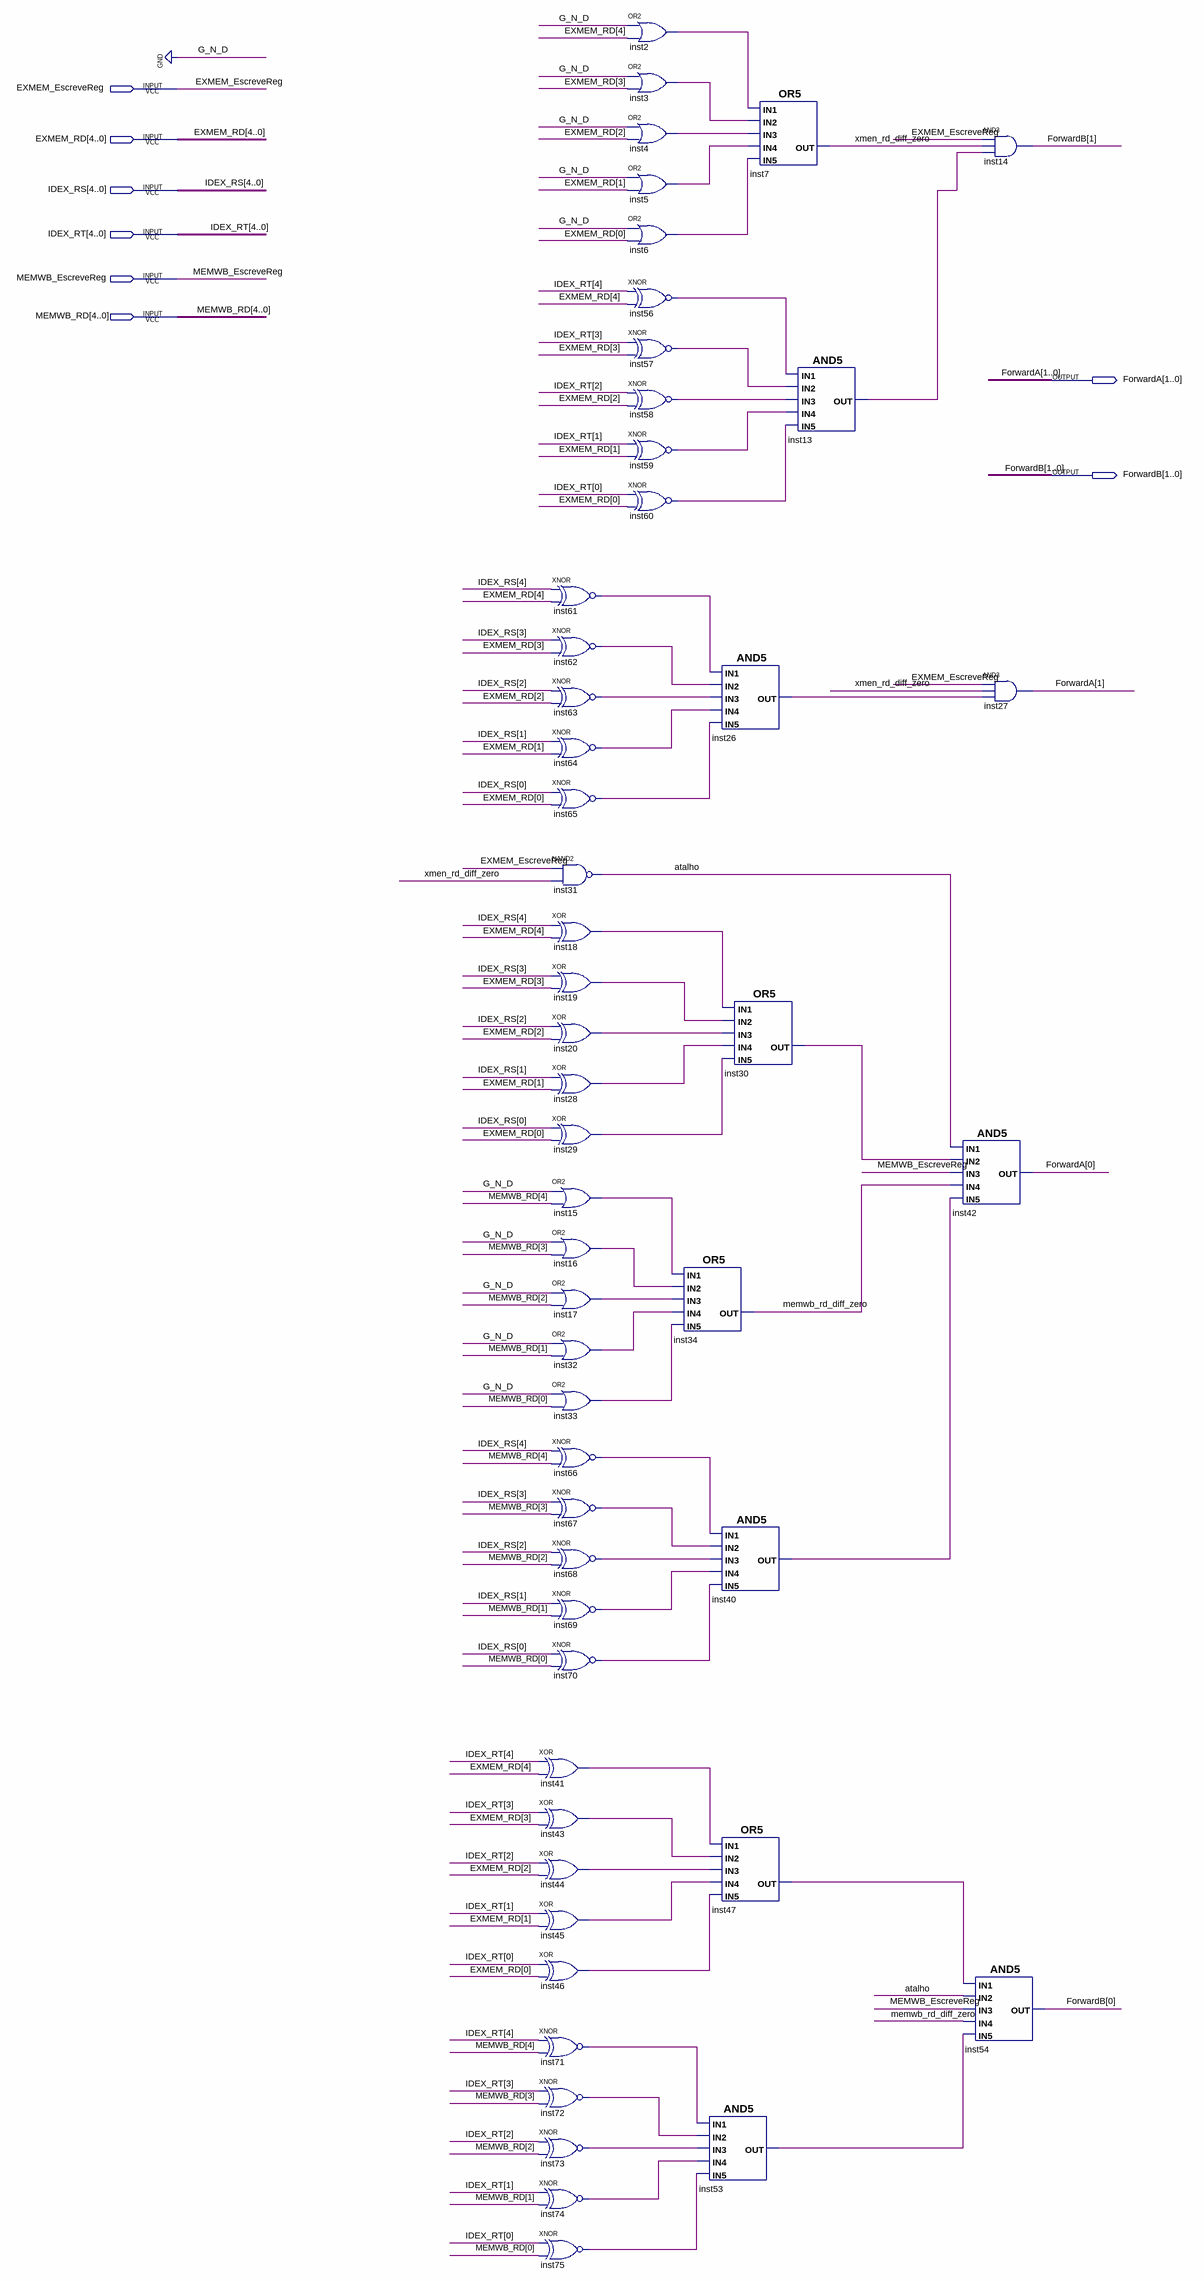
[diagram p0: schematic sheet]
// Quartus schematic unidade_de_forward.bdf as structural Verilog: 53 symbols, 8 pins
module unidade_de_forward (
  input  EXMEM_EscreveReg,
  input  [4:0] EXMEM_RD,
  input  [4:0] IDEX_RS,
  input  [4:0] IDEX_RT,
  input  MEMWB_EscreveReg,
  input  [4:0] MEMWB_RD,
  output [1:0] ForwardA,
  output [1:0] ForwardB
);

  wire atalho, inst2_out, inst3_out, inst4_out, inst5_out, inst6_out, inst13_out, inst15_out, inst16_out,
       inst17_out, inst18_out, inst19_out, inst20_out, inst26_out, inst28_out, inst29_out, inst30_out,
       inst32_out, inst33_out, inst40_out, inst41_out, inst43_out, inst44_out, inst45_out, inst46_out,
       inst47_out, inst53_out, inst56_out, inst57_out, inst58_out, inst59_out, inst60_out, inst61_out,
       inst62_out, inst63_out, inst64_out, inst65_out, inst66_out, inst67_out, inst68_out, inst69_out,
       inst70_out, inst71_out, inst72_out, inst73_out, inst74_out, inst75_out, memwb_rd_diff_zero,
       xmen_rd_diff_zero;

  xor inst41 (inst41_out, IDEX_RT[4], EXMEM_RD[4]);
  xor inst43 (inst43_out, IDEX_RT[3], EXMEM_RD[3]);
  xor inst44 (inst44_out, IDEX_RT[2], EXMEM_RD[2]);
  xor inst45 (inst45_out, IDEX_RT[1], EXMEM_RD[1]);
  xor inst46 (inst46_out, IDEX_RT[0], EXMEM_RD[0]);
  xnor inst71 (inst71_out, IDEX_RT[4], MEMWB_RD[4]);
  xnor inst72 (inst72_out, IDEX_RT[3], MEMWB_RD[3]);
  xnor inst73 (inst73_out, IDEX_RT[2], MEMWB_RD[2]);
  xnor inst74 (inst74_out, IDEX_RT[1], MEMWB_RD[1]);
  xnor inst75 (inst75_out, IDEX_RT[0], MEMWB_RD[0]);
  xnor inst61 (inst61_out, IDEX_RS[4], EXMEM_RD[4]);
  xnor inst62 (inst62_out, IDEX_RS[3], EXMEM_RD[3]);
  xnor inst63 (inst63_out, IDEX_RS[2], EXMEM_RD[2]);
  xnor inst64 (inst64_out, IDEX_RS[1], EXMEM_RD[1]);
  xnor inst65 (inst65_out, IDEX_RS[0], EXMEM_RD[0]);
  nand inst31 (atalho, EXMEM_EscreveReg, xmen_rd_diff_zero);
  xor inst18 (inst18_out, IDEX_RS[4], EXMEM_RD[4]);
  xor inst19 (inst19_out, IDEX_RS[3], EXMEM_RD[3]);
  xor inst20 (inst20_out, IDEX_RS[2], EXMEM_RD[2]);
  xor inst28 (inst28_out, IDEX_RS[1], EXMEM_RD[1]);
  xor inst29 (inst29_out, IDEX_RS[0], EXMEM_RD[0]);
  or inst15 (inst15_out, 1'b0, MEMWB_RD[4]);
  or inst16 (inst16_out, 1'b0, MEMWB_RD[3]);
  or inst17 (inst17_out, 1'b0, MEMWB_RD[2]);
  or inst32 (inst32_out, 1'b0, MEMWB_RD[1]);
  or inst33 (inst33_out, 1'b0, MEMWB_RD[0]);
  xnor inst66 (inst66_out, IDEX_RS[4], MEMWB_RD[4]);
  xnor inst67 (inst67_out, IDEX_RS[3], MEMWB_RD[3]);
  xnor inst68 (inst68_out, IDEX_RS[2], MEMWB_RD[2]);
  xnor inst69 (inst69_out, IDEX_RS[1], MEMWB_RD[1]);
  xnor inst70 (inst70_out, IDEX_RS[0], MEMWB_RD[0]);
  or inst2 (inst2_out, 1'b0, EXMEM_RD[4]);
  or inst3 (inst3_out, 1'b0, EXMEM_RD[3]);
  or inst4 (inst4_out, 1'b0, EXMEM_RD[2]);
  or inst5 (inst5_out, 1'b0, EXMEM_RD[1]);
  or inst6 (inst6_out, 1'b0, EXMEM_RD[0]);
  xnor inst56 (inst56_out, IDEX_RT[4], EXMEM_RD[4]);
  xnor inst57 (inst57_out, IDEX_RT[3], EXMEM_RD[3]);
  xnor inst58 (inst58_out, IDEX_RT[2], EXMEM_RD[2]);
  xnor inst59 (inst59_out, IDEX_RT[1], EXMEM_RD[1]);
  xnor inst60 (inst60_out, IDEX_RT[0], EXMEM_RD[0]);
  or inst34 (memwb_rd_diff_zero, inst15_out, inst16_out, inst17_out, inst32_out, inst33_out);
  and inst53 (inst53_out, inst71_out, inst72_out, inst73_out, inst74_out, inst75_out);
  or inst7 (xmen_rd_diff_zero, inst2_out, inst3_out, inst4_out, inst5_out, inst6_out);
  and inst26 (inst26_out, inst61_out, inst62_out, inst63_out, inst64_out, inst65_out);
  or inst30 (inst30_out, inst18_out, inst19_out, inst20_out, inst28_out, inst29_out);
  and inst40 (inst40_out, inst66_out, inst67_out, inst68_out, inst69_out, inst70_out);
  or inst47 (inst47_out, inst41_out, inst43_out, inst44_out, inst45_out, inst46_out);
  and inst13 (inst13_out, inst56_out, inst57_out, inst58_out, inst59_out, inst60_out);
  and inst42 (ForwardA[0], atalho, inst30_out, MEMWB_EscreveReg, memwb_rd_diff_zero, inst40_out);
  and inst14 (ForwardB[1], EXMEM_EscreveReg, xmen_rd_diff_zero, inst13_out);
  and inst27 (ForwardA[1], EXMEM_EscreveReg, xmen_rd_diff_zero, inst26_out);
  and inst54 (ForwardB[0], inst47_out, atalho, MEMWB_EscreveReg, memwb_rd_diff_zero, inst53_out);
endmodule
